# EasyEDA schematic SCH_Gantry-Sensor-PCB-SMD-2.0_2025-12-20.json
TITLE: Sheet_1; REV: 1.9; Date: 2022-06-12; Sheet: 1/1; Drawn By: Edward Niedziejko; Company: Your Company
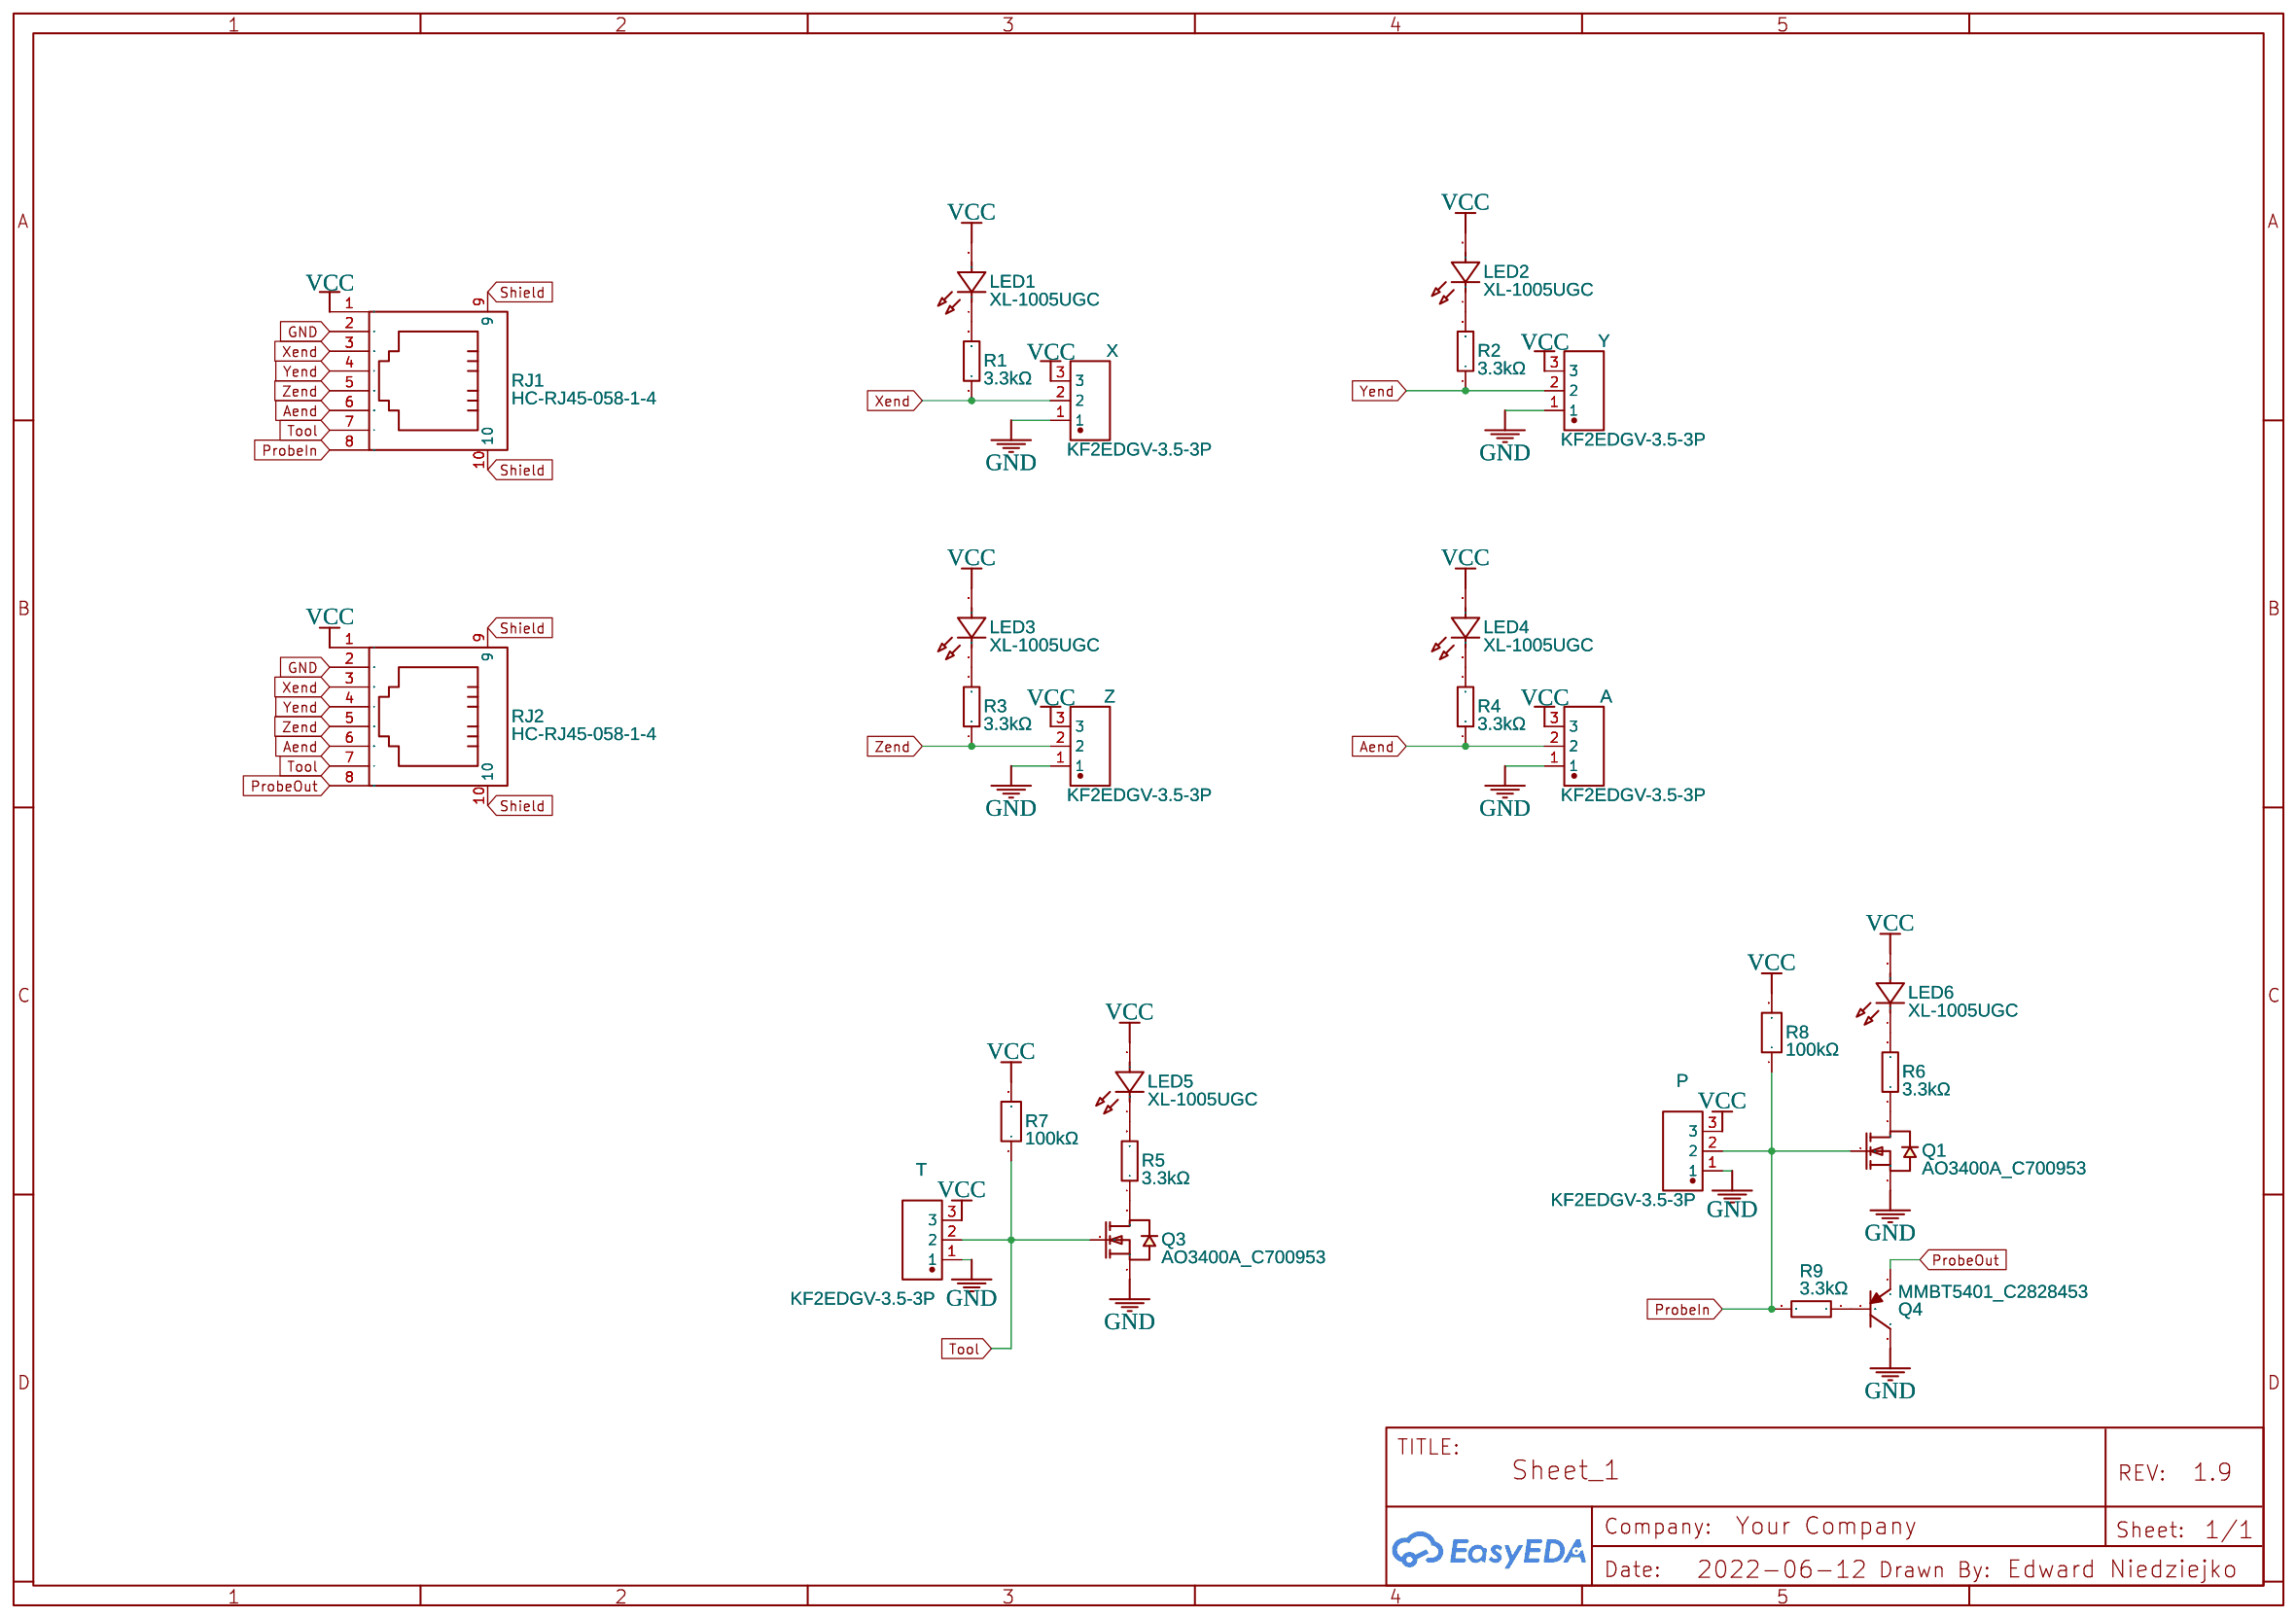
[diagram p0: schematic sheet]

## Parts
A  KF2EDGV-3.5-3P  [CONN-TH_3P-P3.50_KF2EDGV-3.5-3P]
LED1  XL-1005UGC  [LED0402-RD_GREEN]
LED2  XL-1005UGC  [LED0402-RD_GREEN]
LED3  XL-1005UGC  [LED0402-RD_GREEN]
LED4  XL-1005UGC  [LED0402-RD_GREEN]
LED5  XL-1005UGC  [LED0402-RD_GREEN]
LED6  XL-1005UGC  [LED0402-RD_GREEN]
P  KF2EDGV-3.5-3P  [CONN-TH_3P-P3.50_KF2EDGV-3.5-3P]
Q1  AO3400A_C700953  [SOT-23-3_L2.9-W1.3-P1.90-LS2.4-BR]
Q3  AO3400A_C700953  [SOT-23-3_L2.9-W1.3-P1.90-LS2.4-BR]
Q4  MMBT5401_C2828453  [SOT-23-3_L2.9-W1.4-P1.90-LS2.4-TR]
R1  3.3kΩ  [R0402]
R2  3.3kΩ  [R0402]
R3  3.3kΩ  [R0402]
R4  3.3kΩ  [R0402]
R5  3.3kΩ  [R0402]
R6  3.3kΩ  [R0402]
R7  100kΩ  [R0402]
R8  100kΩ  [R0402]
R9  3.3kΩ  [R0402]
RJ1  HC-RJ45-058-1-4  [RJ45-TH_HC-RJ45-058-1-4]
RJ2  HC-RJ45-058-1-4  [RJ45-TH_HC-RJ45-058-1-4]
T  KF2EDGV-3.5-3P  [CONN-TH_3P-P3.50_KF2EDGV-3.5-3P]
X  KF2EDGV-3.5-3P  [CONN-TH_3P-P3.50_KF2EDGV-3.5-3P]
Y  KF2EDGV-3.5-3P  [CONN-TH_3P-P3.50_KF2EDGV-3.5-3P]
Z  KF2EDGV-3.5-3P  [CONN-TH_3P-P3.50_KF2EDGV-3.5-3P]

## Library data of the parts
A P T X Y Z = KF2EDGV-3.5-3P: Contributor: LCSC; Supplier: LCSC; Supplier Part: C441322; Manufacturer: KEFA(科发); JLCPCB Part Class: Extended Part
LED1-LED6 = XL-1005UGC: Contributor: LCSC; Supplier: LCSC; Supplier Part: C965793; Manufacturer: XINGLIGHT(成兴光); JLCPCB Part Class: Extended Part
Q1 Q3 = AO3400A_C700953: Contributor: LCSC; Supplier: LCSC; Supplier Part: C700953; Manufacturer: HUASHUO(华朔); Manufacturer Part: AO3400A; JLCPCB Part Class: Extended Part
Q4 = MMBT5401_C2828453: Contributor: LCSC; Supplier: LCSC; Supplier Part: C2828453; Manufacturer: CBI(创基); Manufacturer Part: MMBT5401 2L; JLCPCB Part Class: Extended Part
R1-R6 R9 = CR0402FF3301G: Supplier: LCSC; Manufacturer: LIZ(丽智电子); Supplier Part: C100376; JLCPCB Part Class: Extended Part
R7 R8 = SCR0402F100K: Contributor: lcsc; Supplier: LCSC; Supplier Part: C3015887; Manufacturer: VO(翔胜); JLCPCB Part Class: Extended Part
RJ1 RJ2 = HC-RJ45-058-1-4: Supplier: LCSC; Supplier Part: C3000196; Manufacturer: HCTL(华灿天禄); JLCPCB Part Class: Extended Part; Contributor: lcsc

## Nets
GND: A.1 P.1 Q1.2(S) Q3.2(S) Q4.3(C) RJ1.2 RJ2.2 T.1 X.1 Y.1 Z.1
VCC: A.3 LED1.2(A) LED2.2(A) LED3.2(A) LED4.2(A) LED5.2(A) LED6.2(A) P.3 R7.2 R8.2 RJ1.1 RJ2.1 T.3 X.3 Y.3 Z.3
Aend: A.2 R4.1 RJ1.6 RJ2.6
ProbeIn: P.2 Q1.1(G) R8.1 R9.2 RJ1.8
ProbeOut: Q4.1(E) RJ2.8
Shield: RJ1.9 RJ1.10 RJ2.9 RJ2.10
Tool: Q3.1(G) R7.1 RJ1.7 RJ2.7 T.2
Xend: R1.1 RJ1.3 RJ2.3 X.2
Yend: R2.1 RJ1.4 RJ2.4 Y.2
Zend: R3.1 RJ1.5 RJ2.5 Z.2
Net-(LED1-1): LED1.1(K) R1.2
Net-(LED2-1): LED2.1(K) R2.2
Net-(LED3-1): LED3.1(K) R3.2
Net-(LED4-1): LED4.1(K) R4.2
Net-(LED5-1): LED5.1(K) R5.2
Net-(LED6-1): LED6.1(K) R6.2
Net-(Q1-3): Q1.3(D) R6.1
Net-(Q3-3): Q3.3(D) R5.1
Net-(Q4-2): Q4.2(B) R9.1
